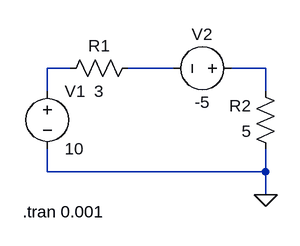
[diagram p0: schematic g2_p3.asc]
g2_p3.asc, the LTspice schematic file:
Version 4
SHEET 1 880 680
WIRE 160 80 128 80
WIRE 304 80 240 80
WIRE 432 80 384 80
WIRE 128 112 128 80
WIRE 432 112 432 80
WIRE 128 224 128 192
WIRE 432 224 432 192
WIRE 432 224 128 224
WIRE 432 256 432 224
FLAG 432 256 0
SYMBOL res 256 64 R90
WINDOW 0 0 56 VBottom 2
WINDOW 3 32 56 VTop 2
SYMATTR InstName R1
SYMATTR Value 3
SYMBOL res 448 208 R180
WINDOW 0 36 76 Left 2
WINDOW 3 36 40 Left 2
SYMATTR InstName R2
SYMATTR Value 5
SYMBOL voltage 128 96 R0
WINDOW 123 0 0 Left 0
WINDOW 39 0 0 Left 0
SYMATTR InstName V1
SYMATTR Value 10
SYMBOL voltage 400 80 R90
WINDOW 0 -32 56 VBottom 2
WINDOW 3 32 56 VTop 2
WINDOW 123 0 0 Left 0
WINDOW 39 0 0 Left 0
SYMATTR InstName V2
SYMATTR Value -5
TEXT 94 280 Left 2 !.tran 0.001

The netlist it stands for:
* g2_p3.asc
R1 N002 N001 3
R2 0 N003 5
V1 N001 0 10
V2 N003 N002 -5
.tran 0.001
.backanno
.end